# Altium schematic sheet MTCH9010_Sensors.SchDoc
size A3; SheetTitle: MTCH9010 Sensors; CompanyName: Microchip Technology Inc.; Organization: Microchip Technology; Address1: 2355 West Chandler Blvd.; Address2: Chandler, AZ  85224; Address4: USA; SheetNumber: 1; SheetTotal: 2; Time: Time
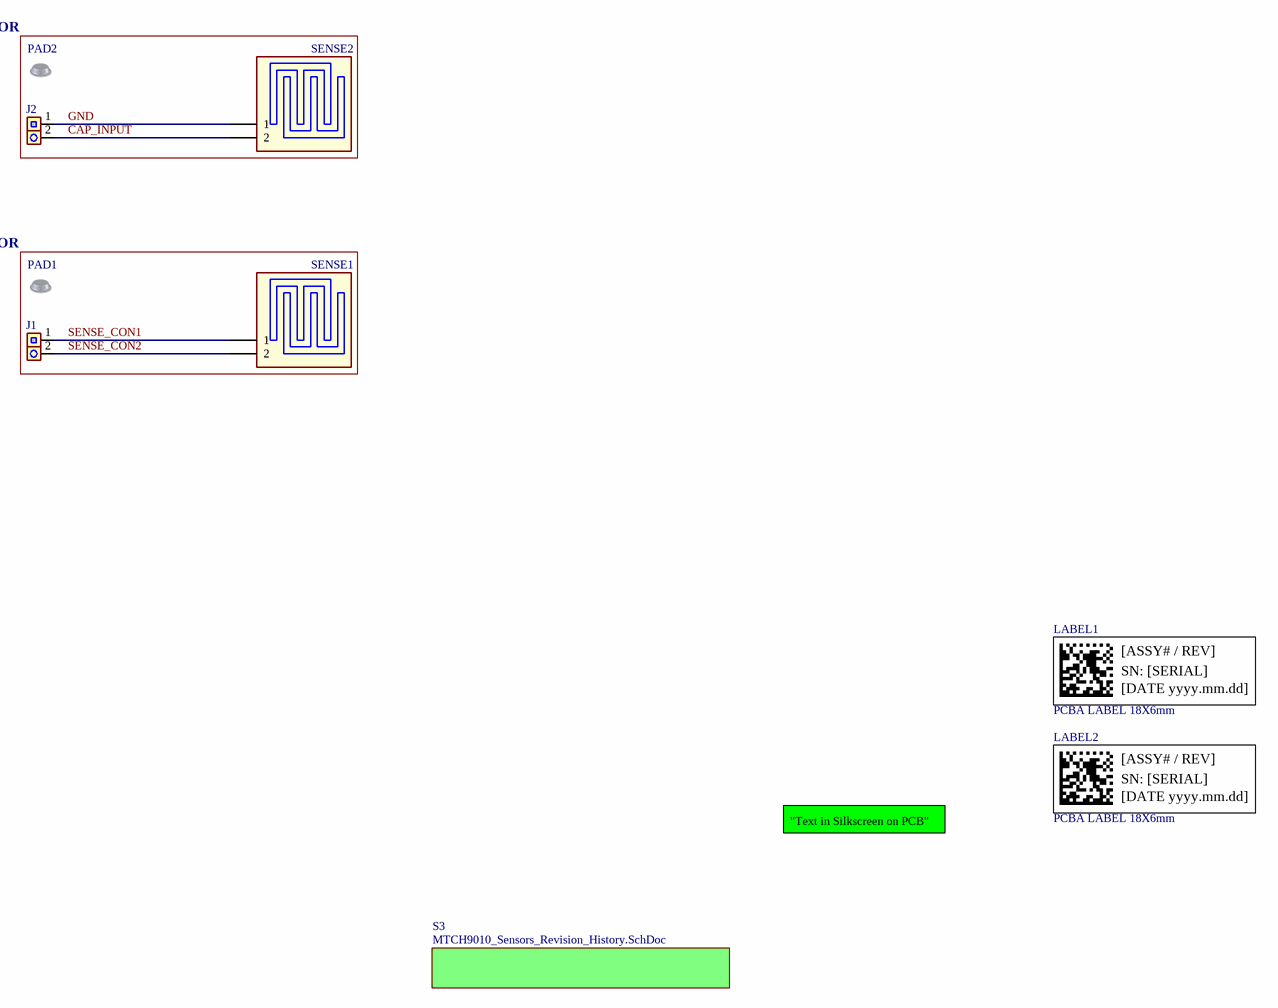
[diagram p0: MTCH9010_Sensors.SchDoc]

## Parts
J1  Header 1x2  [HDR_M_2.54_1X2_U_TH-PIP_RA_WCON_1125-1102S0R140CR01]  (value not drawn)
J2  Header 1x2  [HDR_M_2.54_1X2_U_TH-PIP_RA_WCON_1125-1102S0R140CR01]  (value not drawn)
LABEL1  value PCBA LABEL 18X6mm  [08-10015]  (hidden comment: 08-10015)
LABEL2  value PCBA LABEL 18X6mm  [08-10015]  (hidden comment: 08-10015)
PAD1  Rubber Pad Cylindrical Taper  [BUMP_BUMPERSPECIALTIES_BS06GR10X20RP_CYLINDRICAL_BLACK_D12.7H6.35]  (value not drawn)
PAD2  Rubber Pad Cylindrical Taper  [BUMP_BUMPERSPECIALTIES_BS06GR10X20RP_CYLINDRICAL_BLACK_D12.7H6.35]  (value not drawn)
SENSE1  Liquid_Sensor  [Con_20x20x0.5x0.5]  (value not drawn)  (no BOM)
SENSE2  Liquid_Sensor  [Cap_20x20x1x0.5]  (value not drawn)  (no BOM)

## Blocks framed on the sheet
CAPACITIVE LIQUID SENSOR: J2 PAD2 SENSE2
CONDUCTIVE LIQUID SENSOR: J1 PAD1 SENSE1

## Sub-sheets
S3 = MTCH9010_Sensors_Revision_History.SchDoc: no entries

## Nets
CAP_INPUT: J2.2 SENSE2.2
GND: J2.1 SENSE2.1
SENSE_CON1: J1.1 SENSE1.1
SENSE_CON2: J1.2 SENSE1.2

## Notes on the sheet
- "Text in Silkscreen on PCB"
- Project Owner:
- PCB Layout Contact:
- PartNumber:
- Project Title
- Variant:
- Sheet Title
- Size
- A3
- SCH #:
- PCB #:
- Rev:
- Date:
- Sheet
- Designed with
- Altium.com <http://go.altium.com/MicrochipLandingPage_Evaluation.html>
- File:
- (in symbol 08-10015) [ASSY# / REV]; SN: [SERIAL]; [DATE yyyy.mm.dd]

## Library data of the parts
J1 J2 = CON3018: Manufacturer 1: WCON; Manufacturer Part Number 1: 1125-1102S0R140CR01; Value: HDR-2.54 Male 1x2; Description_: CON HDR-2.54 MALE 1x2 GOLD FLASH/TIN 6.00MH TH-PIP R/A; Voltage: 1kV; Current: 3A; Populated: YES; Restricted Sourcing: No; MCHP-ID: CON3018; Revision: 1; Symbol: Header 1x2; Type: Header 2.54mm; Category: Connector; Supplier 1: Cabcon A/S; Supplier Part Number 1: 1125-1102S0R140CR01; Operating Temperature: -40°C to +105°C; Assembly Type: TH PIP
LABEL1 LABEL2 = 08-10015: Manufacturer 1: ACT Logimark AS; Manufacturer Part Number 1: 505462; Description_: LABEL PCBA 18x6mm Datamatrix Assy# / Rev / Serial / Date; Populated: MECH; MCHP-ID: 08-10015; Revision: 4; Symbol: 08-10015; Category: MCHP-Manufacturing; Type: PCBA Label; Manufacturer 2: Sunrise Paper (M) Sdn Bhd; Manufacturer Part Number 2: 037268-5; Manufacturer 3: Raynen; Manufacturer Part Number 3: 10010407; Supplier 1: ACT Logimark AS; Supplier Part Number 1: 505462; Supplier 2: Microchip Technology; Supplier Part Number 2: 01000-004967; Supplier 3: Raynen; Supplier Part Number 3: 10010407
PAD1 PAD2 = MECH0417: Manufacturer 1: Bumper Specialties Inc.; Manufacturer Part Number 1: BS06GR10X20RP; Value: RUBBER PAD D12.7H6.35mm; Description_: MECH HW RUBBER PAD Cylindrical Flat Top D12.7H6.35mm Gray; Populated: MECH; MCHP-ID: MECH0417; Revision: 3; Symbol: Rubber Pad Cylindrical Taper; Category: Hardware; Supplier 1: Digi-Key; Supplier Part Number 1: 2042-1020-ND; Type: Rubber Pad